# EAGLE design DigiDice (EAGLE 6.1)
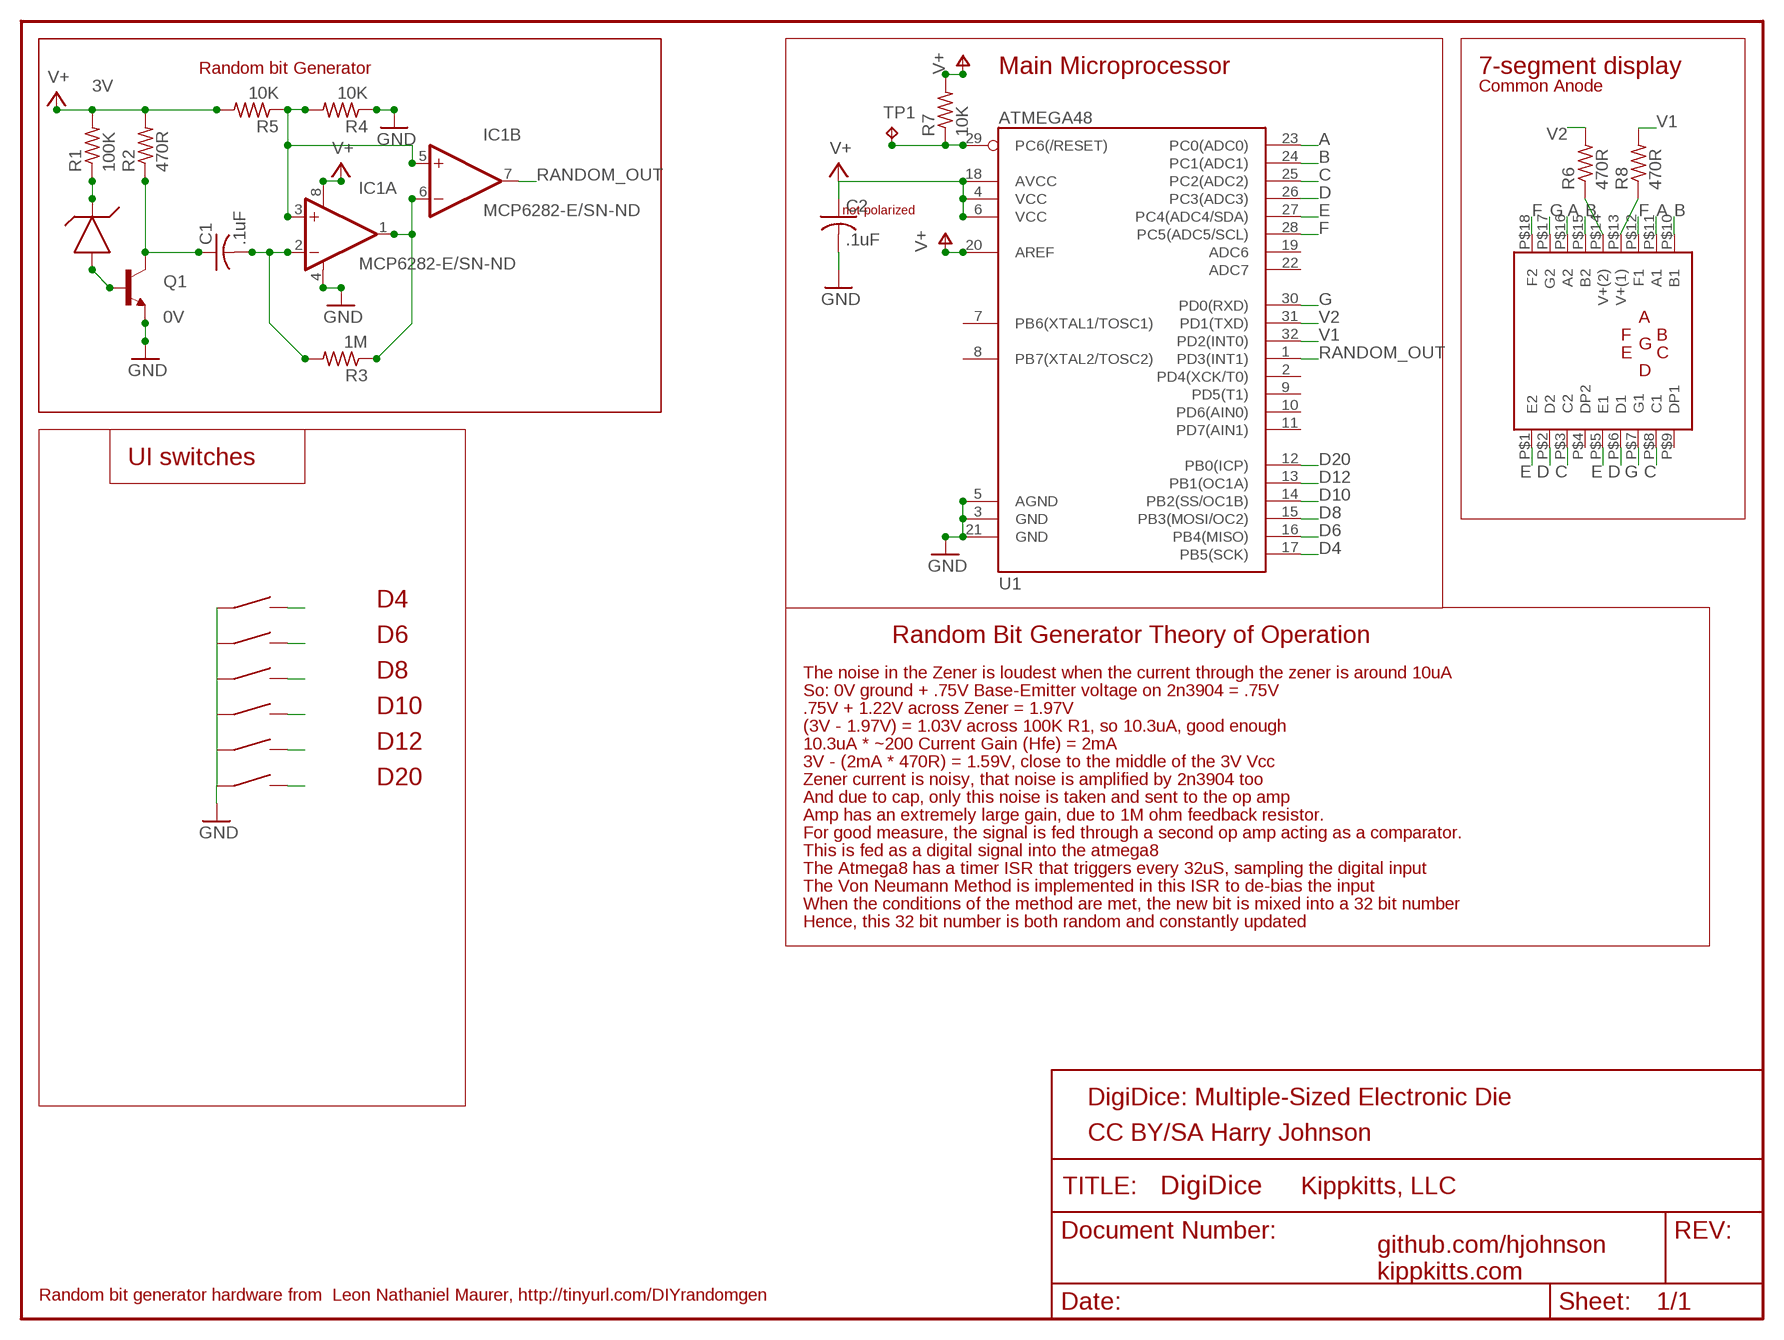
[diagram p0: schematic, sheet 1]

## Parts
C1  .1uF  C-USC0805  [C0805]
C2  .1uF  C-USC0805  [C0805]
IC1  MCP6282-E/SN-ND  OPA2340U  [SO08]
Q1  TRANSISTOR_NPNSOT23  [SOT23]
R1  100K  R-US_R0805  [R0805]
R2  470R  R-US_R0805  [R0805]
R3  1M  R-US_R0805  [R0805]
R4  10K  R-US_R0805  [R0805]
R5  10K  R-US_R0805  [R0805]
R6  470R  R-US_R0805  [R0805]
R7  10K  R-US_R0805  [R0805]
R8  470R  R-US_R0805  [R0805]
SW1  SPST_SWITCH  [EG2513-ND]
SW2  SPST_SWITCH  [EG2513-ND]
SW3  SPST_SWITCH  [EG2513-ND]
SW4  SPST_SWITCH  [EG2513-ND]
SW5  SPST_SWITCH  [EG2513-ND]
SW6  SPST_SWITCH  [EG2513-ND]
TP1  TPB1,27  [B1,27]
U1  ATMEGA48  ATMEGA168  [TQFP32-08]
U$1  ZXRE1004FFTA  [SOT23]
U$2  2DIGIT_7SEGMENT  [HDSP-521E]

## Nets
/RES: R7.1 TP1.TP U1.29(PC6(/RESET))
A: U1.23(PC0(ADC0)) U$2.P$11(A1) U$2.P$16(A2)
B: U1.24(PC1(ADC1)) U$2.P$10(B1) U$2.P$15(B2)
C: U1.25(PC2(ADC2)) U$2.P$3(C2) U$2.P$8(C1)
D: U1.26(PC3(ADC3)) U$2.P$2(D2) U$2.P$6(D1)
D4: SW1.P$2 U1.17(PB5(SCK))
D6: SW2.P$2 U1.16(PB4(MISO))
D8: SW3.P$2 U1.15(PB3(MOSI/OC2))
D10: SW4.P$2 U1.14(PB2(SS/OC1B))
D12: SW5.P$2 U1.13(PB1(OC1A))
D20: SW6.P$2 U1.12(PB0(ICP))
E: U1.27(PC4(ADC4/SDA)) U$2.P$1(E2) U$2.P$5(E1)
F: U1.28(PC5(ADC5/SCL)) U$2.P$12(F1) U$2.P$18(F2)
G: U1.30(PD0(RXD)) U$2.P$7(G1) U$2.P$17(G2)
GND: C2.2 IC1.4(A:V-) Q1.2(E) R4.1 SW1.P$1 SW2.P$1 SW3.P$1 SW4.P$1 SW5.P$1 SW6.P$1 U1.3(GND) U1.5(AGND) U1.21(GND)
N$1: Q1.1(B) U$1.2(A)
N$2: C1.1 Q1.3(C) R2.1
N$3: R1.1 U$1.1(K)
N$4: C1.2 IC1.2(A:-IN) R3.2
N$5: IC1.1(A:OUT) IC1.6(B:-IN) R3.1
N$6: IC1.3(A:+IN) IC1.5(B:+IN) R4.2 R5.1
RANDOM_OUT: IC1.7(B:OUT) U1.1(PD3(INT1))
V1: R8.2 U1.32(PD2(INT0))
V1_LED: R8.1 U$2.P$13(V+(1))
V2: R6.2 U1.31(PD1(TXD))
V2_LED: R6.1 U$2.P$14(V+(2))
V+: C2.1 IC1.8(A:V+) R1.2 R2.2 R5.2 R7.2 U1.4(VCC) U1.6(VCC) U1.18(AVCC) U1.20(AREF)
Unconnected: U1.2(PD4(XCK/T0)) U1.7(PB6(XTAL1/TOSC1)) U1.8(PB7(XTAL2/TOSC2)) U1.9(PD5(T1)) U1.10(PD6(AIN0)) U1.11(PD7(AIN1)) U1.19(ADC6) U1.22(ADC7) U$2.P$4(DP2) U$2.P$9(DP1)

## Notes on the sheet
- Random bit Generator | Main Microprocessor | 7-segment display
- 3V | Common Anode
- not polarized
- 0V
- UI switches
- D4
- D6 | Random Bit Generator Theory of Operation
- D8 | The noise in the Zener is loudest when the current through the zener is around 10uA
- So: 0V ground + .75V Base-Emitter voltage on 2n3904 = .75V
- D10 | .75V + 1.22V across Zener = 1.97V
- (3V - 1.97V) = 1.03V across 100K R1, so 10.3uA, good enough
- D12 | 10.3uA * ~200 Current Gain (Hfe) = 2mA
- 3V - (2mA * 470R) = 1.59V, close to the middle of the 3V Vcc
- D20 | Zener current is noisy, that noise is amplified by 2n3904 too
- And due to cap, only this noise is taken and sent to the op amp
- Amp has an extremely large gain, due to 1M ohm feedback resistor.
- For good measure, the signal is fed through a second op amp acting as a comparator.
- This is fed as a digital signal into the atmega8
- The Atmega8 has a timer ISR that triggers every 32uS, sampling the digital input
- The Von Neumann Method is implemented in this ISR to de-bias the input
- When the conditions of the method are met, the new bit is mixed into a 32 bit number
- Hence, this 32 bit number is both random and constantly updated
- DigiDice: Multiple-Sized Electronic Die
- CC BY/SA Harry Johnson
- Kippkitts, LLC
- github.com/hjohnson
- kippkitts.com
- Random bit generator hardware from  Leon Nathaniel Maurer, http://tinyurl.com/DIYrandomgen

## Library data of the parts
C1 C2 = adafruit:C-US: CAPACITOR, American symbol
IC1 = burr-brown:OPA2340: Single-Supply, Rail-to-Rail Operational Amplifiers MicroAmplifier(TM) Series; Product Folder:OPA2340; MF: TEXAS INSTRUMENTS; MPN: OPA2340UA; OC_FARNELL: 1101541; OC_NEWARK: 36K7581
Q1 = SparkFun:TRANSISTOR_NPN: Transistor NPN BJT configuration in SOT23 package. MMBT2222 is the common NPN we use. Double check BCE configuration again layout.
R1-R8 = adafruit:R-US_: RESISTOR, American symbol
SW1-SW6 = hjohnson_library:SPST_SWITCH
TP1 = testpad:TP: Test pad
U1 = SparkFun:ATMEGA168
U$1 = hjohnson_library:ZXRE1004FFTA
U$2 = hjohnson_library:2DIGIT_7SEGMENT

## Board
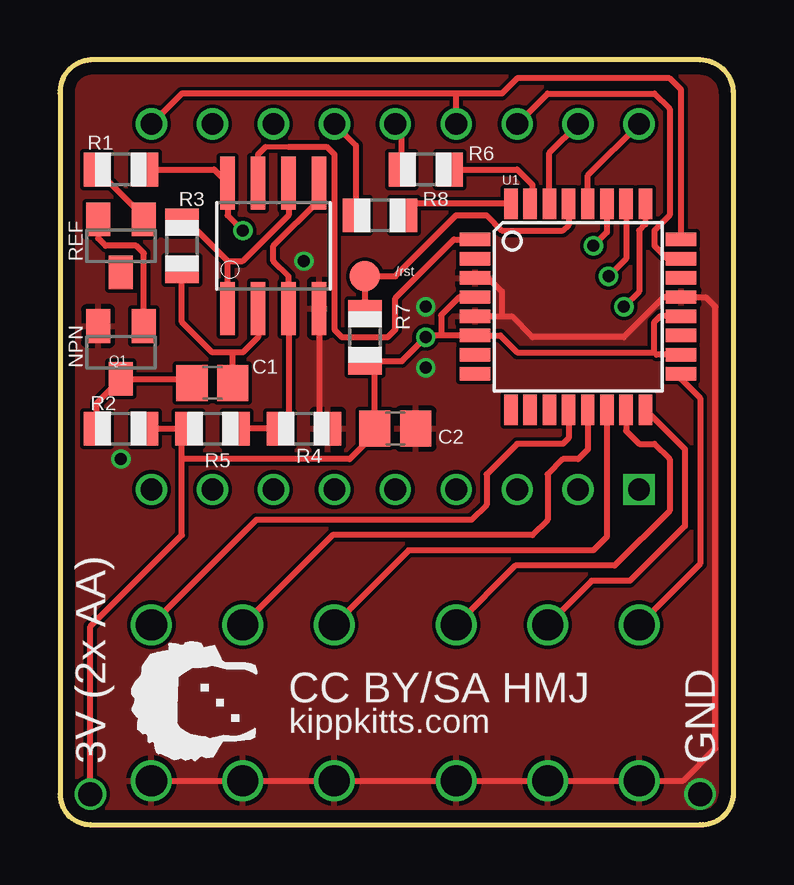
[diagram p1: board, top side]
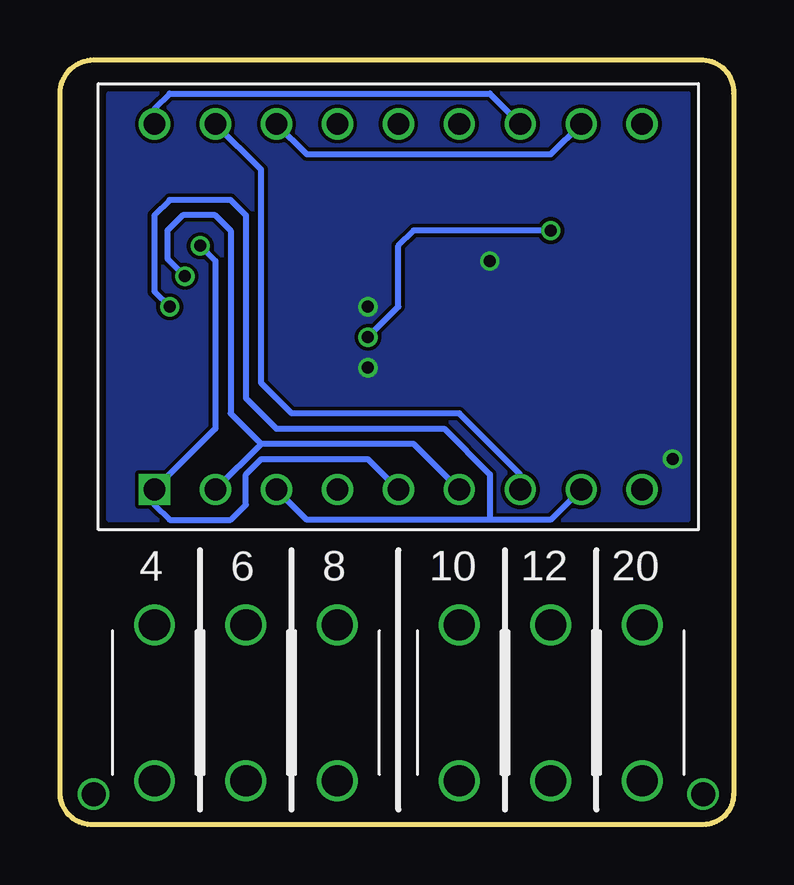
[diagram p2: board, bottom side, seen from below]

Size 28.07 x 31.88 mm. Coordinates in mm from the lower left corner, seen from the top.
Outline: 0,30.48 0,1.27 arc90 1.27,0 26.67,0 arc90 28.07,1.27 28.07,30.48 arc90 26.67,31.88 1.27,31.88 arc90 0,30.48
Copper layers (1*16): Top 0.035mm / dielectric 1.5mm / Bottom 0.035mm
Design rules: minimum track width 6mil, minimum drill 12mil, track to track 6mil, track to pad 6mil, pad to pad 6mil, via to via 6mil, smd to smd 6mil, copper to edge 20mil, drill to drill 8mil, minimum pad ring 8mil, minimum via ring 6mil, stop-mask expansion 3mil, vias tented up to drill 0mil, thermal gap 8mil

### Footprints (pad centres in the part's own frame; a part is rotated, then mirrored left to right if it is on the bottom)
C0805 = smd 1.3 x 1.5: 1 -0.85,0; 2 0.85,0
SO08 = smd 0.61 x 2.21: 1 -1.905,-2.616; 2 -0.635,-2.616; 3 0.635,-2.616; 4 1.905,-2.616; 5 1.905,2.616; 6 0.635,2.616; 7 -0.635,2.616; 8 -1.905,2.616
SOT23 = smd 1 x 1.4: 1 -0.95,-1.1; 2 0.95,-1.1; 3 0,1.1
R0805 = smd 1.1 x 1.4: 1 -1,0; 2 1,0
EG2513-ND = drill 1.3: P$1 -3.25,0; P$2 3.25,0
B1,27 = smd 1.27 x 1.27: TP 0,0
TQFP32-08 = smd 1.27 x 0.559: 1 -4.293,2.8; 2 -4.293,2; 3 -4.293,1.2; 4 -4.293,0.4; 5 -4.293,-0.4; 6 -4.293,-1.2; 7 -4.293,-2; 8 -4.293,-2.8; 17 4.293,-2.8; 18 4.293,-2; 19 4.293,-1.2; 20 4.293,-0.4; 21 4.293,0.4; 22 4.293,1.2; 23 4.293,2; 24 4.293,2.8 | smd 0.559 x 1.27: 9 -2.8,-4.293; 10 -2,-4.293; 11 -1.2,-4.293; 12 -0.4,-4.293; 13 0.4,-4.293; 14 1.2,-4.293; 15 2,-4.293; 16 2.8,-4.293; 25 2.8,4.293; 26 2,4.293; 27 1.2,4.293; 28 0.4,4.293; 29 -0.4,4.293; 30 -1.2,4.293; 31 -2,4.293; 32 -2.8,4.293
HDSP-521E = drill 0.9 square: P$1 -10.16,-7.62 | drill 0.9: P$2 -7.62,-7.62; P$3 -5.08,-7.62; P$4 -2.54,-7.62; P$5 0,-7.62; P$6 2.54,-7.62; P$7 5.08,-7.62; P$8 7.62,-7.62; P$9 10.16,-7.62; P$10 10.16,7.62; P$11 7.62,7.62; P$12 5.08,7.62; P$13 2.54,7.62; P$14 0,7.62; P$15 -2.54,7.62; P$16 -5.08,7.62; P$17 -7.62,7.62; P$18 -10.16,7.62

### Placement (x,y rotation side)
C1  6.35,18.42 0 top
C2  13.97,16.51 0 top
IC1  8.89,24.13 0 top
Q1  2.54,19.69 180 top
R1  2.54,27.31 0 top
R2  2.54,16.51 0 top
R3  5.08,24.13 270 top
R4  10.16,16.51 180 top
R5  6.35,16.51 180 top
R6  15.24,27.31 0 top
R7  12.7,20.32 270 top
R8  13.34,25.4 0 top
SW1  24.13,5.08 90 bottom
SW2  20.32,5.08 90 bottom
SW3  16.51,5.08 90 bottom
SW4  11.43,5.08 90 bottom
SW5  7.62,5.08 90 bottom
SW6  3.81,5.08 90 bottom
TP1  12.7,22.86 0 top
U1  21.59,21.59 0 top
U$1  2.54,24.13 180 top
U$2  13.97,21.59 0 bottom
U$4  [TOP_DOCU_5MM]  8.89,1.91 90 top

### Tracks (layer width: path | path; a pad name or v marks a point on that pad's centre or on a via)
/RES
  Top 0.254: R7.1 TP1.TP 13.97,22.86 16.51,25.4 17.78,25.4 18.42,24.77 20.96,24.77 21.19,25 U1.29
A
  Top 0.254: U$2.P$16 20.32,30.48 24.77,30.48 25.4,29.85 25.4,25.4 24.77,24.77 24.77,24.13 25.31,23.59 U1.23
  Bottom 0.254: U$2.P$16 17.78,27.94 7.62,27.94 U$2.P$11
B
  Top 0.254: U1.24 25.88,30.63 25.4,31.12 19.05,31.12 18.42,30.48 16.51,30.48 | 16.51,30.48 5.08,30.48 U$2.P$10 | U$2.P$15 16.51,30.48
C  (via drill 0.5)
  Top 0.254: U1.25 24.39,25.03 24.13,24.77 24.13,22.23 v23.5,21.59
  Bottom 0.254: U$2.P$8 7.62,12.7 10.16,12.7 | 10.16,12.7 17.78,12.7 U$2.P$3 | 10.16,12.7 10.16,14.61 12.07,16.51 19.05,16.51 20.32,17.78 20.32,25.4 20.96,26.04 23.5,26.04 24.13,25.4 24.13,22.23 v23.5,21.59
D  (via drill 0.5)
  Top 0.254: U1.26 23.59,23.59 v22.86,22.86
  Bottom 0.254: U$2.P$6 13.34,15.88 19.69,15.88 | 19.69,15.88 U$2.P$2 | 19.69,15.88 20.96,17.15 20.96,24.77 21.59,25.4 22.96,25.4 23.59,24.77 23.59,23.59 v22.86,22.86
D4
  Top 0.254: U1.17 25.88,18.57 26.67,17.78 26.67,10.87 SW1.P$2
D6
  Top 0.254: U1.16 26.04,15.65 26.04,12.45 23.75,10.16 22.15,10.16 SW2.P$2
D8
  Top 0.254: U1.15 23.59,16.42 24.13,15.88 24.77,15.88 25.4,15.24 25.4,13.09 23.11,10.8 18.98,10.8 SW3.P$2
D10
  Top 0.254: U1.14 22.79,12 22.23,11.43 14.53,11.43 SW4.P$2
D12
  Top 0.254: U1.13 21.99,15.64 21.59,15.24 20.96,15.24 20.32,14.61 20.32,12.7 19.69,12.07 11.36,12.07 SW5.P$2
D20
  Top 0.254: U1.12 21.19,16.11 20.96,15.88 19.05,15.88 17.78,14.61 17.78,13.34 17.15,12.7 8.18,12.7 SW6.P$2
E  (via drill 0.5)
  Top 0.254: U1.27 22.79,24.7 v22.23,24.13
  Bottom 0.254: U$2.P$5 15.24,15.24 19.69,15.24 20.32,14.61 20.32,13.34 20.96,12.7 23.5,12.7 24.13,13.34 U$2.P$1 21.59,16.51 21.59,23.5 v22.23,24.13
F
  Top 0.254: U1.28 21.99,27.07 U$2.P$18
  Bottom 0.254: U$2.P$18 24.13,29.85 23.5,30.48 10.16,30.48 U$2.P$12
G
  Top 0.254: U1.30 20.39,28.01 U$2.P$17
  Bottom 0.254: U$2.P$7 8.89,14.61 11.43,17.15 18.42,17.15 19.69,18.42 19.69,27.31 U$2.P$17
GND  (via drill 0.5, 1)
  Top 0.254: SW6.P$1 SW5.P$1 SW4.P$1 | SW4.P$1 SW3.P$1 SW2.P$1 SW1.P$1 | IC1.4 10.8,16.24 R4.1 | U1.5 18.42,21.19 | 18.42,21.19 18.82,21.19 19.69,20.32 23.5,20.32 25.17,21.99 U1.21 26.91,21.99 27.31,21.59 27.31,3.18 25.96,1.83 SW4.P$1 | 18.42,21.19 18.42,22.23 17.85,22.79 U1.3 17.23,22.86
  other vias: 15.24,21.59 26.67,1.27 2.54,15.24 10.16,23.5 15.24,19.05
  pour Top: 0,0 27.94,0 27.94,31.75 0,31.75
  pour Bottom: 1.91,12.7 26.04,12.7 26.04,30.48 1.91,30.48
N$1
  Top 0.254: Q1.1 3.49,23.82 3.18,24.13 1.91,24.13 1.59,24.45 U$1.2
N$2
  Top 0.254: R2.1 1.54,17.59 Q1.3 5.33,18.59 C1.1
N$3
  Top 0.254: U$1.1 3.49,25.36 R1.1
N$4
  Top 0.254: IC1.2 8.26,20.32 7.62,19.69 7.2,19.69 | R3.2 5.08,20.96 6.35,19.69 7.2,19.69 | C1.2 7.2,19.69
N$5
  Top 0.254: IC1.6 9.53,25.4 7.62,23.5 6.99,23.5 | R3.1 5.35,25.13 6.99,23.5 | IC1.1 6.99,23.5
N$6
  Top 0.254: R5.1 R4.2 9.53,16.24 IC1.3 9.53,22.86 8.89,23.5 8.89,24.13 10.8,26.04 IC1.5
RANDOM_OUT
  Top 0.203: 8.57,28.26 9.53,28.26
  Top 0.254: U1.1 16.41,24.39 13.97,21.95 13.97,20.64 13.65,20.32 11.75,20.32 11.43,20.64 11.43,27.94 11.11,28.26 9.53,28.26 | IC1.7 8.26,27.94 8.57,28.26
V1
  Top 0.254: U1.32 14.82,25.88 R8.2
V1_LED
  Top 0.254: R8.1 12.34,28.31 U$2.P$13
V2
  Top 0.254: R6.2 19.05,27.31 19.69,26.67 19.69,25.98 U1.31
V2_LED
  Top 0.254: R6.1 14.24,28.94 U$2.P$14
V+  (via drill 0.5, 1)
  Top 0.254: R2.2 5.08,16.51 | 5.08,16.51 R5.2 | R1.2 6.43,27.31 IC1.8 6.99,25.4 v7.62,24.77 | 5.08,15.24 12.07,15.24 12.7,15.88 12.7,16.09 C2.1 13.12,18.9 | U1.20 25,21.19 24.77,20.96 24.77,19.69 | U1.18 24.86,19.59 24.77,19.69 | 24.77,19.69 19.05,19.69 18.35,20.39 U1.6 15.88,20.39 | v1.27,1.27 1.27,8.26 5.08,12.07 5.08,15.24 | 5.08,15.24 5.08,16.51 | 13.12,18.9 R7.2 14.24,19.32 v15.24,20.32 15.31,20.39 15.88,20.39 | 13.12,18.9 13.19,18.9 | U1.4 16.63,21.99 15.88,21.24 15.88,20.39
  Bottom 0.254: v7.62,24.77 13.34,24.77 13.97,24.13 13.97,21.59 v15.24,20.32

### Text on the board
tPlace: REF | /rst | NPN | CC BY/SA HMJ | kippkitts.com | 3V (2x AA) | GND
bPlace: 20 | 12 | 10 | 8 | 6 | 4